# Altium schematic sheet charger.SchDoc
size 825 x 762 mm
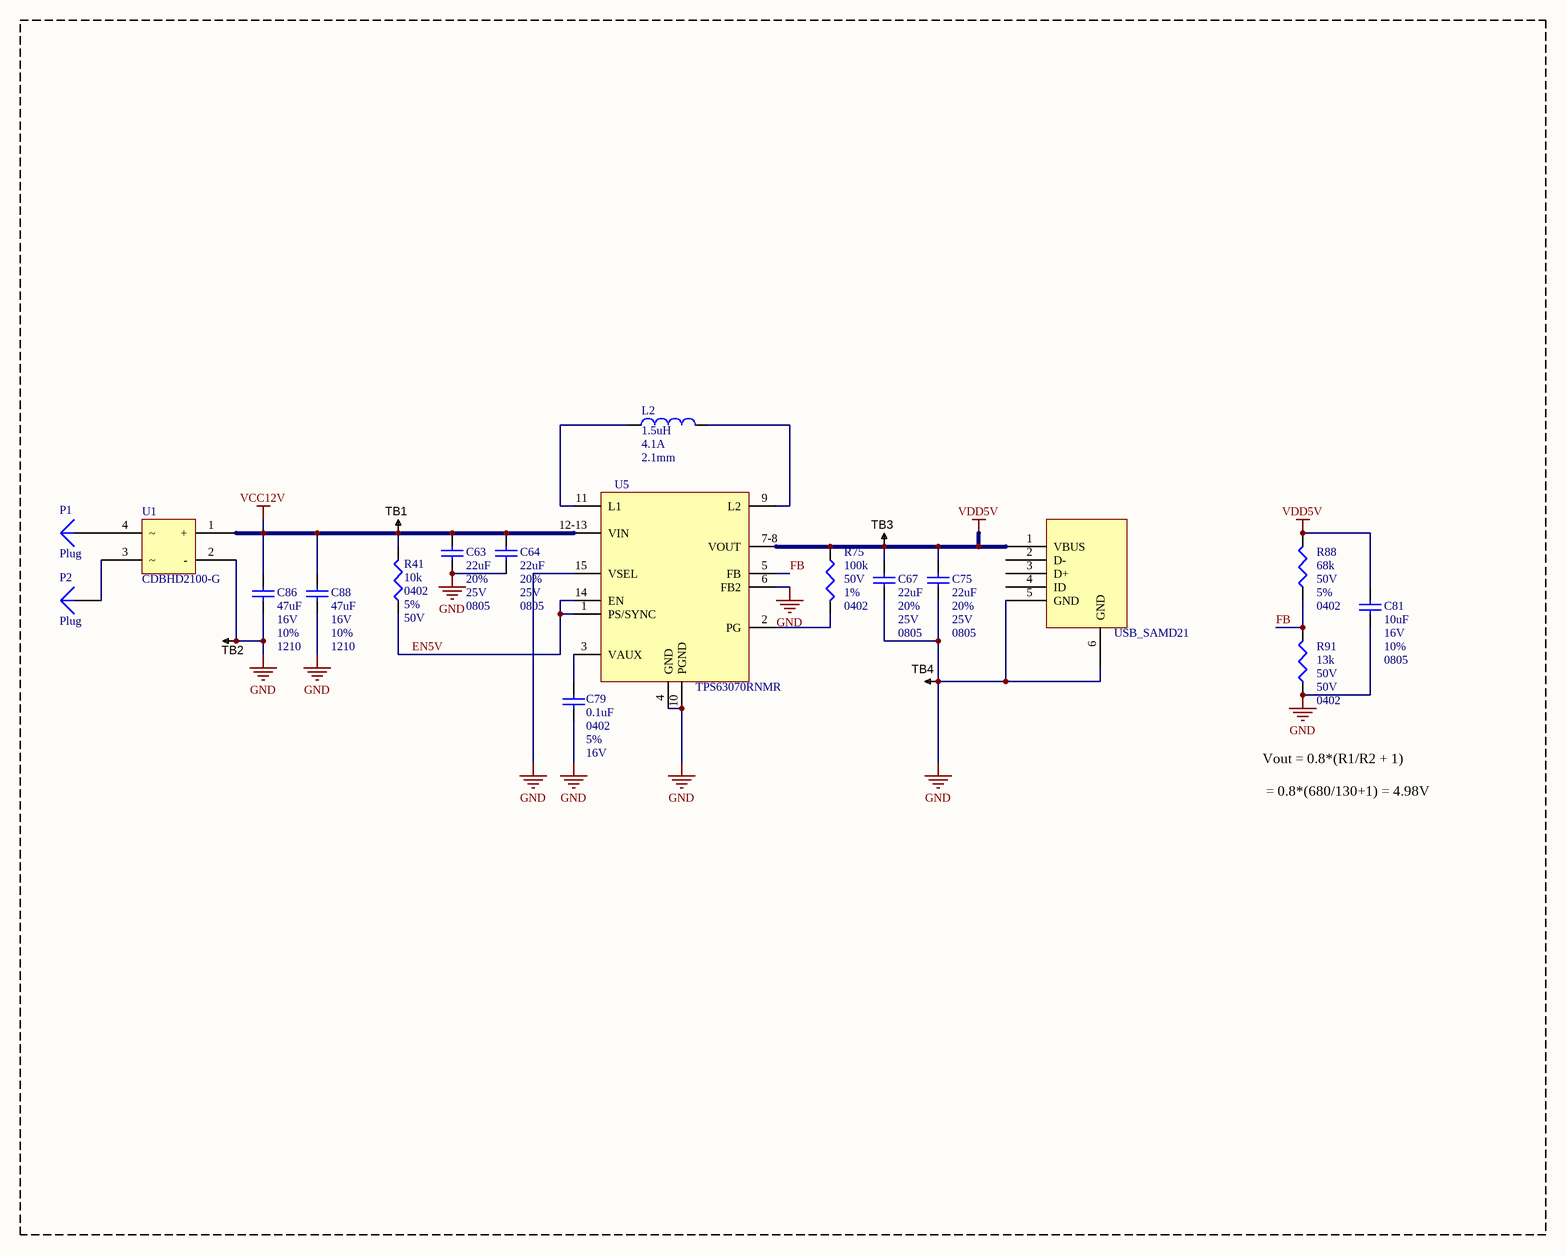
[diagram p0: charger.SchDoc]

## Parts
C63  value 22uF  Case/Package: 0805  Voltage Rating: 25V  Tolerance: 20%  [C0805]  (hidden comment: Cap Semi)
C64  value 22uF  Case/Package: 0805  Voltage Rating: 25V  Tolerance: 20%  [C0805]  (hidden comment: Cap Semi)
C67  value 22uF  Case/Package: 0805  Voltage Rating: 25V  Tolerance: 20%  [C0805]  (hidden comment: Cap Semi)
C75  value 22uF  Case/Package: 0805  Voltage Rating: 25V  Tolerance: 20%  [C0805]  (hidden comment: Cap Semi)
C79  value 0.1uF  Case Code (Imperial): 0402  Tolerance: 5%  Voltage Rating: 16V  [C0402]  (hidden comment: Cap Semi)
C81  value 10uF  Case/Package: 0805  Tolerance: 10%  Voltage: 16V  [C0805]  (hidden comment: Cap Semi)
C86  value 47uF  Case/Package: 1210  Tolerance: 10%  Voltage: 16V  [C1210]  (hidden comment: Cap Semi)
C88  value 47uF  Case/Package: 1210  Tolerance: 10%  Voltage: 16V  [C1210]  (hidden comment: Cap Semi)
L2  value 1.5uH  Saturation Current: 4.1A  Height: 2.1mm  [INDM4040X210]  (hidden comment: Inductor)
P1  Plug  [Pogo_RightAngle]
P2  Plug  [Pogo_RightAngle]
R41  value 10k  Case/Package: 0402  Tolerance: 5%  Voltage Rating: 50V  [R0402]  (hidden comment: Res3)
R75  value 100k  Case/Package: 0402  Tolerance: 1%  Voltage Rating: 50V  [R0402]  (hidden comment: Res3)
R88  value 68k  Case/Package: 0402  Tolerance: 5%  Voltage Rating: 50V  [R0402]  (hidden comment: Res3)
R91  value 13k  Case/Package: 0402  Voltage Rating: 50V  [R0402]  (hidden comment: Res3)
TB1  TESTPOINT  [TP-R40]  (value not drawn)  (no BOM)
TB2  TESTPOINT  [TP-R40]  (value not drawn)  (no BOM)
TB3  TESTPOINT  [TP-R40]  (value not drawn)  (no BOM)
TB4  TESTPOINT  [TP-R40]  (value not drawn)  (no BOM)
U1  CDBHD2100-G  [CDBHD2100-G]
U5  TPS63070RNMR  [QFN50P250X300X100-15N_TPS63070RNMR(Primary)]
USB_SAMD21  USB MICRO SMD  [MicroUSB B Plug]  (value not drawn)

## Nets
GND: C63.1 C64.1 C67.1 C75.1 C79.2 C81.1 C86.1 C88.1 R91.1 TB2.1 TB4.1 U1.2(-) U5.4(GND) U5.6(FB2) U5.10(PGND) U5.15(VSEL) USB_SAMD21.5(GND) USB_SAMD21.6(GND)
VCC12V: C63.2 C64.2 C86.2 C88.2 R41.2 TB1.1 U1.1(+) U5.12-13(VIN)
VDD5V: C67.2 C75.2 C81.2 R75.1 R88.2 TB3.1 U5.7-8(VOUT) USB_SAMD21.1(VBUS)
EN5V: R41.1 U5.1(PS/SYNC) U5.14(EN)
FB: R88.1 R91.2 U5.5(FB)
NetC79_1: C79.1 U5.3(VAUX)
NetL2_1: L2.1 U5.11(L1)
NetL2_2: L2.2 U5.9(L2)
NetP1_1: P1.1 U1.4
NetP2_1: P2.1 U1.3
NetR75_2: R75.2 U5.2(PG)

Not connected (* = marked no-connect by the designer): USB_SAMD21 2(D-) 3(D+) 4(ID)

## Notes on the sheet
- Vout = 0.8*(R1/R2 + 1)
  = 0.8*(680/130+1) = 4.98V

## Library data of the parts
C63 C64 C67 C75 = Cap Semi: Capacitor (Semiconductor SIM Model); Manufacturer: Murata; Manufacturer Part Number: GRM21BR61E226ME44K; Dielectric: X5R; Supplier 1: Digi-Key; Supplier Part Number 1: 490-14661-1-ND; Stock 1: 36449; Pricing 1: 1=0.49, 10=0.348, 100=0.2291, 500=0.1697, 1000=0.1443, 2500=0.1358, 5000=0.1273 (USD); Mount: Surface Mount; Weight: 0.000335oz; Case Code (Imperial): 0805; Case Code (Metric): 2012; Min Operating Temperature: -55°C; Max Operating Temperature: 85°C; Packaging: Tape and Reel; Capacitance: 22uF; Termination: SMD/SMT; Composition: Ceramic; Voltage Rating (DC): 25V; Package Quantity: 10000; Length: 0.079inch; Height: 1.25mm; Width: 1.25mm; Thickness: 0.057inch
C79 = Cap Semi: Capacitor (Semiconductor SIM Model); Manufacturer: Yageo; Manufacturer Part Number: CC0402JRX7R7BB104; Capacitance: 100nF; Dielectric: X7R; Supplier 1: Digi-Key; Supplier Part Number 1: 311-1676-1-ND; Stock 1: 874792; Pricing 1: 1=0.1, 10=0.057, 100=0.0256, 500=0.0183, 1000=0.0144, 2500=0.0131, 5000=0.012 (USD); Mount: Surface Mount; Case/Package: 0402; Case Code (Metric): 1005; Min Operating Temperature: -55°C; Max Operating Temperature: 125°C; Packaging: Tape and Reel; Package Quantity: 10000; Voltage Rating (DC): 16V; Composition: Ceramic; Length: 1mm; Height: 0.5mm; Width: 0.02inch; Thickness: 0.022inch; Depth: 0.5mm; Radiation Hardening: No; Lead Free: Lead Free; Halogen Free: Halogen Free; ComponentLink1URL: http://www.mouser.com/ds/2/447/Yageo_UPY-GP_NP0_16V-to-50V_9-358835.pdf; ComponentLink1Description: http://www.mouser.com/ds/2/447/Yageo_UPY-GP_NP0_16V-to-50V_9-358835.pdf; ComponentLink2URL: http://www.yageo.com/documents/recent/UPY-GPHC_X7R_6.3V-to-50V_8.pdf; ComponentLink2Description: http://www.yageo.com/documents/recent/UPY-GPHC_X7R_6.3V-to-50V_8.pdf
C81 = Cap Semi: Capacitor; Manufacturer: Samsung; Manufacturer Part Number: CL21A106KOQNNNG; Material: Ceramic; Dielectric: X5R; Supplier 1: Digi-Key; Supplier Part Number 1: 1276-6455-1-ND; Stock 1: 30000; Pricing 1: 1=0.14, 10=0.099, 100=0.0463, 500=0.0325, 1000=0.0269 (USD); Mount: Surface Mount; Case Code (Metric): 2012; Case Code (Imperial): 0805; Min Operating Temperature: -55°C; Max Operating Temperature: 85°C; Packaging: Tape and Reel; Package Quantity: 3000; Capacitance: 10uF; Voltage Rating: 16V; Length: 2mm; Height: 1.25mm; Width: 0.049inch; Thickness: 0.053inch; Depth: 1.25mm; ComponentLink1URL: http://www.samsungsem.com/kr/support/product-search/mlcc/CL21A106KOQNNNG.jsp; ComponentLink1Description: http://www.samsungsem.com/kr/support/product-search/mlcc/CL21A106KOQNNNG.jsp; ComponentLink2URL: https://produktinfo.conrad.com/datenblaetter/450000-474999/454932-da-01-en-VS_KONDENSATOR_0805.pdf; ComponentLink2Description: https://produktinfo.conrad.com/datenblaetter/450000-474999/454932-da-01-en-VS_KONDENSATOR_0805.pdf
C86 C88 = Cap Semi: Capacitor (Semiconductor SIM Model); Manufacturer: Murata; Manufacturer Part Number: GRM32EC81C476KE15L; Material: Ceramic; Dielectric: X6S; Supplier 1: Digi-Key; Supplier Part Number 1: 490-10531-1-ND; Stock 1: 39077; Pricing 1: 1=0.78, 10=0.571, 100=0.3917, 500=0.3101 (USD); Mount: Surface Mount; Weight: 0.00388oz; Case Code (Metric): 3225; Case Code (Imperial): 1210; Min Operating Temperature: -55°C; Max Operating Temperature: 105°C; Capacitance: 47uF; Packaging: Tape and Reel; Voltage Rating: 16V; Termination: SMD/SMT; Voltage Rating (DC): 16V; Package Quantity: 1000; Length: 3.2mm; Height: 2.5mm; Width: 2.5mm; Thickness: 0.106inch; Depth: 2.5mm; REACH SVHC: No SVHC; Lead Free: Lead Free; ComponentLink1URL: http://www.farnell.com/datasheets/2048597.pdf?src-supplier=Element14; ComponentLink1Description: http://www.farnell.com/datasheets/2048597.pdf?src-supplier=Element14
L2 = Inductor: Manufacturer: Coilcraft; Manufacturer Part Number: XFL4020-152MEC; Core Material: Composite; Tolerance: 20%; Self Resonant Frequency: 59MHz; Shielding: Shielded; Max DC Current: 9.1A; DC Resistance (DCR): 15.8mR; Test Frequency: 100kHz; Supplier 1: Mouser; Supplier Part Number 1: 994-XFL4020-152MEC; Stock 1: 28664; Pricing 1: 1=1.99, 10=1.99, 50=1.99, 100=1.59, 1000=0.885, 10000=0.885 (USD); Mount: Surface Mount; Case/Package: SMD/SMT; Min Operating Temperature: -40°C; Max Operating Temperature: 125°C; Packaging: Tape and Reel; Inductance: 1.5uh; Termination: SMD/SMT; Inductance Tolerance: 20%; RMS Current (Irms): 9.1A; Length: 4.3mm; Width: 4.3mm; Lead Free: Contains Lead; REACH SVHC: No SVHC; ComponentLink1URL: http://www.mouser.com/ds/2/597/xfl4020-270756.pdf; ComponentLink1Description: http://www.mouser.com/ds/2/597/xfl4020-270756.pdf; ComponentLink2URL: http://www.farnell.com/datasheets/1682010.pdf; ComponentLink2Description: http://www.farnell.com/datasheets/1682010.pdf
R41 = Res3: Resistor; Manufacturer: TE Connectivity; Manufacturer Part Number: CRG0402J10K/10; Resistance: 10kR; Temperature Coefficient: 200ppm/°C; Power Rating: 63mW; Number of Resistors: 1; Supplier 1: Digi-Key; Supplier Part Number 1: 311-10KJRCT-ND; Supplier 2: Digi-Key; Supplier Part Number 2: A106045CT-ND; Stock 2: 164304; Pricing 2: 1=0.1, 10=0.016, 100=0.0064, 1000=0.0029, 2500=0.0025, 5000=0.0021 (USD); Mount: Surface Mount; Weight: 2.3E-05oz; Case Code (Imperial): 0402; Case Code (Metric): 1005; Min Operating Temperature: -55°C; Max Operating Temperature: 125°C; Packaging: Tape and Reel; Composition: Thick Film; Package Quantity: 10000; Number of Terminations: 2; Termination: Solder; Voltage Rating (DC): 50V; Length: 1mm; Height: 0.35mm; Width: 0.5mm; Depth: 0.5mm; Radiation Hardening: No; REACH SVHC: Unknown; ELV: Compliant; ComponentLink1URL: http://uk.rs-online.com/webdocs/13e2/0900766b813e23cb.pdf; ComponentLink1Description: http://uk.rs-online.com/webdocs/13e2/0900766b813e23cb.pdf; ComponentLink2URL: http://www.farnell.com/datasheets/1610603.pdf; ComponentLink2Description: http://www.farnell.com/datasheets/1610603.pdf; ComponentLink3URL: http://www.mouser.com/ds/2/418/NG_CD_1622826_BA1-677535.pdf; ComponentLink3Description: http://www.mouser.com/ds/2/418/NG_CD_1622826_BA1-677535.pdf; ComponentLink4URL: http://www.te.com/commerce/DocumentDelivery/DDEController?Action=showdoc&DocId=Data+Sheet%7F1773204%7FF%7Fpdf%7FEnglish%7FENG_DS_1773204_F.pdf; ComponentLink4Description: http://www.te.com/commerce/DocumentDelivery/DDEController?Action=showdoc&DocId=Data+Sheet%7F1773204%7FF%7Fpdf%7FEnglish%7FENG_DS_1773204_F.pdf
R75 = Res3: Resistor; Manufacturer: Yageo; Manufacturer Part Number: RC0402FR-07100KL; Resistance: 100kR; Temperature Coefficient: 100ppm/°C; Power Rating: 63mW; Supplier 1: Digi-Key; Supplier Part Number 1: 311-100KLRCT-ND; Stock 1: 62177550; Pricing 1: 1=0.1, 10=0.016, 100=0.0067, 1000=0.003, 2500=0.0026, 5000=0.0022 (USD); Case Code (Metric): 1005; Case Code (Imperial): 0402; Min Operating Temperature: -55°C; Max Operating Temperature: 155°C; Packaging: Tape and Reel; Composition: Thick Film; Termination: SMD/SMT; Military Standard: Not; Number of Terminations: 2; Working Voltage: 50V; Package Quantity: 1; Max Power Dissipation: 63mW; Features: Moisture Resistant; Length: 0.039inch; Height: 0.016inch; Width: 0.02inch; Depth: 0.5mm; REACH SVHC: No SVHC; Lead Free: Lead Free; ComponentLink1URL: http://www.yageo.com/documents/recent/PYu-RC_Group_51_RoHS_L_10.pdf?src-supplier=Digi-Key; ComponentLink1Description: http://www.yageo.com/documents/recent/PYu-RC_Group_51_RoHS_L_10.pdf?src-supplier=Digi-Key; ComponentLink2URL: http://www.farnell.com/datasheets/1018594.pdf?src-supplier=Element14; ComponentLink2Description: http://www.farnell.com/datasheets/1018594.pdf?src-supplier=Element14; ComponentLink3URL: http://www.yageo.com/documents/recent/PYu-RC_Group_51_RoHS_L_9.pdf?src-supplier=Verical; ComponentLink3Description: http://www.yageo.com/documents/recent/PYu-RC_Group_51_RoHS_L_9.pdf?src-supplier=Verical; ComponentLink4URL: http://www.yageo.com/documents/recent/PYu-RC_Group_51_RoHS_L_9.pdf?src-supplier=Mouser; ComponentLink4Description: http://www.yageo.com/documents/recent/PYu-RC_Group_51_RoHS_L_9.pdf?src-supplier=Mouser; ComponentLink5URL: http://documents.rs-components.com/techlib://itc_doclist_GB.htm?stockno=6185797&src-supplier=RSComponents; ComponentLink5Description: http://documents.rs-components.com/techlib://itc_doclist_GB.htm?stockno=6185797&src-supplier=RSComponents
R88 = Res3: Resistor; Manufacturer: Yageo; Manufacturer Part Number: RC0402JR-0768KL; Resistance: 68kR; Power Rating: 63mW; Temperature Coefficient: 100ppm/°C; Supplier 1: Digi-Key; Supplier Part Number 1: 311-68KJRCT-ND; Stock 1: 2047315; Pricing 1: 1=0.1, 10=0.013, 100=0.0055, 1000=0.0025, 2500=0.0021, 5000=0.0018 (USD); Number of Pins: 2; Case Code (Imperial): 0402; Case Code (Metric): 1005; Min Operating Temperature: -55°C; Max Operating Temperature: 155°C; Packaging: Tape and Reel; Package Quantity: 1; Features: Moisture Resistant; Voltage Rating (DC): 50V; Termination: SMD/SMT; Composition: Thick Film; Number of Terminations: 2; Military Standard: Not; Max Power Dissipation: 63mW; Working Voltage: 50V; Length: 1mm; Height: 0.016inch; Width: 0.02inch; Depth: 0.5mm; Lead Free: Lead Free; REACH SVHC: No SVHC; ComponentLink1URL: http://www.yageo.com/documents/recent/PYu-RC_Group_51_RoHS_L_9.pdf; ComponentLink1Description: http://www.yageo.com/documents/recent/PYu-RC_Group_51_RoHS_L_9.pdf; ComponentLink2URL: http://www.yageo.com/documents/recent/PYu-RC_Group_51_RoHS_L_10.pdf; ComponentLink2Description: http://www.yageo.com/documents/recent/PYu-RC_Group_51_RoHS_L_10.pdf; ComponentLink3URL: http://www.farnell.com/datasheets/1018594.pdf; ComponentLink3Description: http://www.farnell.com/datasheets/1018594.pdf
R91 = Res3: Resistor; Manufacturer: Yageo; Manufacturer Part Number: RC0402FR-0713KL; Tolerance: 1%; Resistance: 13kR; Power Rating: 62.5mW; Temperature Coefficient: 100ppm/°C; Max Power Dissipation: 63mW; Supplier 1: Digi-Key; Supplier Part Number 1: 311-13.0KLRCT-ND; Stock 1: 1193115; Pricing 1: 1=0.1, 10=0.016, 100=0.0067, 1000=0.003, 2500=0.0026, 5000=0.0022 (USD); Mount: Surface Mount; Case Code (Metric): 1005; Case Code (Imperial): 0402; Min Operating Temperature: -55°C; Max Operating Temperature: 155°C; Package Quantity: 10000; Packaging: Tape and Reel; Composition: Thick Film; Number of Terminations: 2; Termination: SMD/SMT; Military Standard: Not; Voltage Rating (DC): 50V; Working Voltage: 50V; Features: Moisture Resistant; Length: 1mm; Height: 0.016inch; Width: 0.02inch; Depth: 0.5mm; Lead Free: Lead Free; ComponentLink1URL: http://www.yageo.com/documents/recent/PYu-RC_Group_51_RoHS_L_9.pdf; ComponentLink1Description: http://www.yageo.com/documents/recent/PYu-RC_Group_51_RoHS_L_9.pdf; ComponentLink2URL: http://www.yageo.com/documents/recent/PYu-RC_Group_51_RoHS_L_10.pdf; ComponentLink2Description: http://www.yageo.com/documents/recent/PYu-RC_Group_51_RoHS_L_10.pdf; ComponentLink3URL: http://documents.rs-components.com/techlib://itc_doclist_GB.htm?stockno=6185961; ComponentLink3Description: http://documents.rs-components.com/techlib://itc_doclist_GB.htm?stockno=6185961; ComponentLink4URL: http://www.mouser.com/ds/2/447/PYu-RC0402_51_RoHS_L_6_r-8721.pdf; ComponentLink4Description: http://www.mouser.com/ds/2/447/PYu-RC0402_51_RoHS_L_6_r-8721.pdf
TB1-TB4 = TESTPOINT: SMD test pin
U1 = DIODE_BRIDGE_100V_2A: BRIDGE RECT 1P 100V 2A MINI-DIP; Manufacturer: Comchip; Description: DIODE BRIDGE 2A 100V TO-269AA; Max Surge Current: 50A; Max Reverse Leakage Current: 500uA; Supplier 1: Digi-Key; Manufacturer Part Number: CDBHD2100-G; Stock 1: 28798; Pricing 1: 1=1.26, 10=1.125, 25=1.068, 100=0.8772, 250=0.82, 500=0.7246, 1000=0.5721 (USD); Mount: Surface Mount; Package Quantity: 2500; Packaging: Tape and Reel; ComponentLink1URL: http://media.digikey.com/PDF/Data%20Sheets/Comchip%20PDFs/CDBHD280-G%20thru%202100-G.PDF?src-supplier=Digi-Key; ComponentLink1Description: http://media.digikey.com/PDF/Data%20Sheets/Comchip%20PDFs/CDBHD280-G%20thru%202100-G.PDF?src-supplier=Digi-Key; ComponentLink2URL: http://www.comchiptech.com/admin/files/product/CDBHD240-G%20Thru.%20CDBHD2100-G%20%20%20%20%20RevC.PDF?src-supplier=Digi-Key; ComponentLink2Description: http://www.comchiptech.com/admin/files/product/CDBHD240-G%20Thru.%20CDBHD2100-G%20%20%20%20%20RevC.PDF?src-supplier=Digi-Key; ComponentLink3URL: http://www.mouser.com/ds/2/80/CDBHD240-G%20Thru.%20CDBHD2100-G%20%20%20%20%20RevC-766412.pdf?src-supplier=Mouser; ComponentLink3Description: http://www.mouser.com/ds/2/80/CDBHD240-G%20Thru.%20CDBHD2100-G%20%20%20%20%20RevC-766412.pdf?src-supplier=Mouser; Supplier Part Number 1: 641-1212-1-ND
U5 = TPS63070RNMR: Wide Input Voltage _2V-16V_ Buck-Boost Converter 15-VQFN-HR; MF: Texas Instruments; Number of Outputs: 1; Min Input Voltage: 2V; Max Input Voltage: 16V; Min Output Voltage: 2.5V; Max Output Voltage: 9V; Output Current: 2A; Switching Frequency: 2.4MHz; Synchronous Rectifier: Yes; Quiescent Current: 50uA; Output Type: Adjustable; Output Configuration: Positive; Digi-Key_Part_Number: 296-44874-1-ND; Package: VQFN-15 Texas Instruments; Digi-Key_Purchase_URL: https://www.digikey.com/product-detail/en/texas-instruments/TPS63070RNMR/296-44874-1-ND/6217416?utm_source=snapeda&utm_medium=aggregator&utm_campaign=symbol; SnapEDA_Link: https://www.snapeda.com/parts/TPS63070RNMR/Texas%20Instruments/view-part/?ref=snap; MP: TPS63070RNMR; Value: *; Supplier 1: Digi-Key; Manufacturer: Texas Instruments; Manufacturer Part Number: TPS63070RNMR; Stock 1: 31678; Pricing 1: 1=2.67, 10=2.402, 100=1.9306, 500=1.5862, 1000=1.3143 (USD); Mount: Surface Mount; Case/Package: VQFN; Number of Pins: 15; Min Operating Temperature: -40°C; Max Operating Temperature: 125°C; Packaging: Tape and Reel; Topology: Buck-Boost; Lead Free: Lead Free; Supplier Part Number 1: 296-44874-1-ND
USB_SAMD21 = USB MICRO SMD: CONN RCPT USB MICRO AB SMD R/A
P1 P2 = Plug: LatestRevisionDate: 17-Jul-2002; LatestRevisionNote: Re-released for DXP Platform.; Publisher: Altium Limited